# Altium schematic sheet HubHub.SchDoc
size Legal; CompanyName: Ploopy Co; Organization: Ploopy Co; Address1: 137-1140 Burnhamthorpe Road W; Address2: Mississauga; Address3: Ontario; Address4: Canada L5C 0A3; DocumentNumber: 7; Revision: R1.001; SheetNumber: 7; SheetTotal: 7
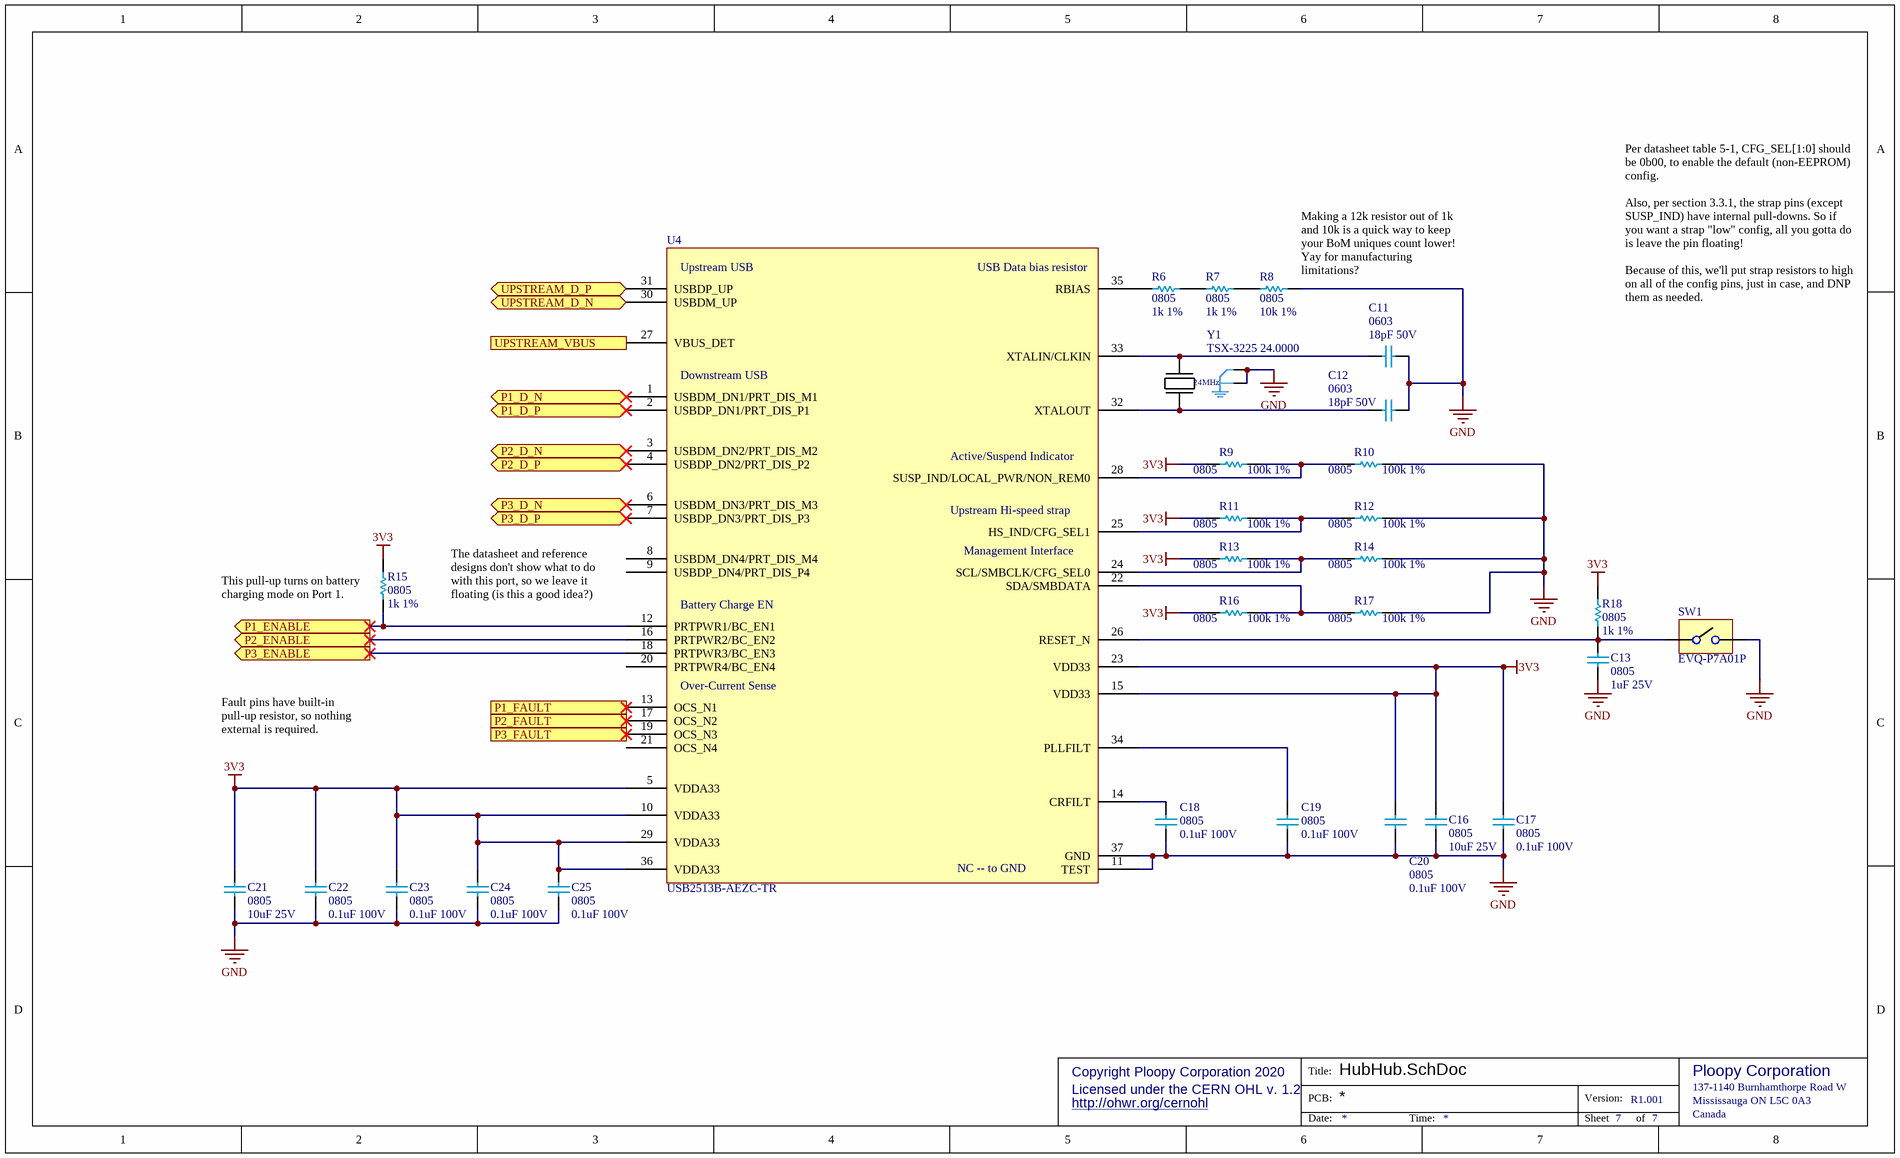
[diagram p0: HubHub.SchDoc]

## Parts
C11  0603  value 18pF 50V  [0603]
C12  0603  value 18pF 50V  [0603]
C13  0805  value 1uF 25V  [0805]
C16  0805  value 10uF 25V  [0805]
C17  0805  value 0.1uF 100V  [0805]
C18  0805  value 0.1uF 100V  [0805]
C19  0805  value 0.1uF 100V  [0805]
C20  0805  value 0.1uF 100V  [0805]
C21  0805  value 10uF 25V  [0805]
C22  0805  value 0.1uF 100V  [0805]
C23  0805  value 0.1uF 100V  [0805]
C24  0805  value 0.1uF 100V  [0805]
C25  0805  value 0.1uF 100V  [0805]
R6  0805  value 1k 1%  [0805]
R7  0805  value 1k 1%  [0805]
R8  0805  value 10k 1%  [0805]
R9  0805  value 100k 1%  [0805]
R10  0805  value 100k 1%  [0805]
R11  0805  value 100k 1%  [0805]
R12  0805  value 100k 1%  [0805]
R13  0805  value 100k 1%  [0805]
R14  0805  value 100k 1%  [0805]
R15  0805  value 1k 1%  [0805]
R16  0805  value 100k 1%  [0805]
R17  0805  value 100k 1%  [0805]
R18  0805  value 1k 1%  [0805]
SW1  EVQ-P7A01P  [EVQ-PQHB55]
U4  USB2513B-AEZC-TR  [USB2513B - QFN50P600X600X100_HS-37M]
Y1  TSX-3225 24.0000  [TSX-3225]

## Ports
P1_D_N (bidir), P1_D_P (bidir), P1_ENABLE (out), P1_FAULT (in), P2_D_N (bidir), P2_D_P (bidir), P2_ENABLE (out), P2_FAULT (in), P3_D_N (bidir), P3_D_P (bidir), P3_ENABLE (out), P3_FAULT (in), UPSTREAM_D_N (bidir), UPSTREAM_D_P (bidir), UPSTREAM_VBUS (in)

## Nets
3V3: C16.2 C17.2 C20.2 C21.2 C22.2 C23.2 C24.2 C25.2 R9.1 R11.1 R13.1 R15.2 R16.1 R18.2 U4.5(VDDA33) U4.10(VDDA33) U4.15(VDD33) U4.23(VDD33) U4.29(VDDA33) U4.36(VDDA33)
GND: C11.1 C12.1 C13.1 C16.1 C17.1 C18.1 C19.1 C20.1 C21.1 C22.1 C23.1 C24.1 C25.1 R8.1 R10.1 R12.1 R14.1 R17.1 SW1.B U4.11(TEST) U4.37(GND) Y1.2 Y1.4
P1_D_N: U4.1(USBDM_DN1/PRT_DIS_M1) ; port P1_D_N
P1_D_P: U4.2(USBDP_DN1/PRT_DIS_P1) ; port P1_D_P
P1_ENABLE: R15.1 U4.12(PRTPWR1/BC_EN1) ; port P1_ENABLE
P1_FAULT: U4.13(OCS_N1) ; port P1_FAULT
P2_D_N: U4.3(USBDM_DN2/PRT_DIS_M2) ; port P2_D_N
P2_D_P: U4.4(USBDP_DN2/PRT_DIS_P2) ; port P2_D_P
P2_ENABLE: U4.16(PRTPWR2/BC_EN2) ; port P2_ENABLE
P2_FAULT: U4.17(OCS_N2) ; port P2_FAULT
P3_D_N: U4.6(USBDM_DN3/PRT_DIS_M3) ; port P3_D_N
P3_D_P: U4.7(USBDP_DN3/PRT_DIS_P3) ; port P3_D_P
P3_ENABLE: U4.18(PRTPWR3/BC_EN3) ; port P3_ENABLE
P3_FAULT: U4.19(OCS_N3) ; port P3_FAULT
UPSTREAM_D_N: U4.30(USBDM_UP) ; port UPSTREAM_D_N
UPSTREAM_D_P: U4.31(USBDP_UP) ; port UPSTREAM_D_P
UPSTREAM_VBUS: U4.27(VBUS_DET) ; port UPSTREAM_VBUS
NetC11_2: C11.2 U4.33(XTALIN/CLKIN) Y1.1
NetC12_2: C12.2 U4.32(XTALOUT) Y1.3
NetC13_2: C13.2 R18.1 SW1.A U4.26(RESET_N)
NetC18_2: C18.2 U4.14(CRFILT)
NetC19_2: C19.2 U4.34(PLLFILT)
NetR6_1: R6.1 R7.2
NetR6_2: R6.2 U4.35(RBIAS)
NetR7_1: R7.1 R8.2
NetR9_2: R9.2 R10.2 U4.28(SUSP_IND/LOCAL_PWR/NON_REM0)
NetR11_2: R11.2 R12.2 U4.25(HS_IND/CFG_SEL1)
NetR13_2: R13.2 R14.2 U4.24(SCL/SMBCLK/CFG_SEL0)
NetR16_2: R16.2 R17.2 U4.22(SDA/SMBDATA)

Not connected (* = marked no-connect by the designer): U4 8(USBDM_DN4/PRT_DIS_M4) 9(USBDP_DN4/PRT_DIS_P4) 20(PRTPWR4/BC_EN4) 21(OCS_N4)

## Notes on the sheet
- (near R8) Making a 12k resistor out of 1k and 10k is a quick way to keep your BoM uniques count lower! Yay for manufacturing limitations?
- Per datasheet table 5-1, CFG_SEL[1:0] should be 0b00, to enable the default (non-EEPROM) config.
  Also, per section 3.3.1, the strap pins (except SUSP_IND) have internal pull-downs. So if you want a strap "low" config, all you gotta do is leave the pin floating!
  Because of this, we'll put strap resistors to high on all of the config pins, just in case, and DNP them as needed.
- (near R15) This pull-up turns on battery charging mode on Port 1.
- The datasheet and reference designs don't show what to do with this port, so we leave it floating (is this a good idea?)
- Fault pins have built-in pull-up resistor, so nothing external is required.
- Copyright Ploopy Corporation 2020
- Licensed under the CERN OHL v. 1.2
- http://ohwr.org/cernohl
- Title:
- PCB:
- Version:
- Ploopy Corporation
- Mississauga ON L5C 0A3
- 137-1140 Burnhamthorpe Road W
- Date:
- Time:
- Sheet
- of
- Canada
- (in symbol TSX-3225 24.0000) 24MHz
- (in symbol USB2513B-AEZC-TR) Upstream USB; USB Data bias resistor; Downstream USB; Active/Suspend Indicator; Upstream Hi-speed strap; Management Interface; Battery Charge EN; Over-Current Sense; NC -- to GND

## Library data of the parts
C11 C12 = Cap 18pF 50V: 0603, C0G or better; Supplier 1: Digi-Key; Supplier Part Number 1: 1292-1494-1-ND
C13 = Cap 1uF 25V: 0805, X5R or better; Supplier 1: Digi-Key; Supplier Part Number 1: 1276-1066-2-ND; Supplier 2: Digi-Key; Supplier Part Number 2: 1276-1066-1-ND
C16 C21 = Cap 10uF 25V: 0805, X5R or better; Supplier 1: Mouser; Supplier Part Number 1: 81-GRM21BR61E106KA3L; Supplier 2: Digi-Key; Supplier Part Number 2: 490-5523-1-ND
C17-C20 C22-C25 = Cap 0.1uF 100V: 0805, X5R or better; Supplier 1: Digi-Key; Supplier Part Number 1: 1276-6840-2-ND
R6 R7 R15 R18 = Res 1k 1% 0805: Chip resistor, 1/8W 100PPM; Supplier 1: Digi-Key; Supplier Part Number 1: RMCF0805FT1K00TR-ND
R8 = Res 10k 1% 0805: Chip resistor; Supplier 1: Digi-Key; Supplier Part Number 1: RMCF0805FT10K0TR-ND
R9-R14 R16 R17 = Res 100k 1% 0805: Chip resistor; Supplier 1: Digi-Key; Supplier 2: Digi-Key; Supplier Part Number 1: RMCF0805FT100KTR-ND; Supplier Part Number 2: RMCF0805FT100KCT-ND
SW1 = EVQ-P7A01P: Tactile Switches 3.5x2.9mm Right Ang Light Touch Switch
U4 = USB2513B-AEZC-TR: USB Hub Controller USB 2.0 USB Interface 36-QFN (6x6); Supplier 1: Digi-Key; Supplier 2: Mouser; Supplier Part Number 1: USB2513B-AEZC-CT-ND; Supplier Part Number 2: 886-USB2513B-AEZCTR
Y1 = TSX-3225 24.0000: 24MHz ±10ppm Crystal 9pF 40 Ohms 4-SMD, No Lead; Supplier 1: Digi-Key; Supplier 2: Mouser; Supplier Part Number 2: 732-22524MF15X-AC6; Supplier Part Number 1: SER4180CT-ND